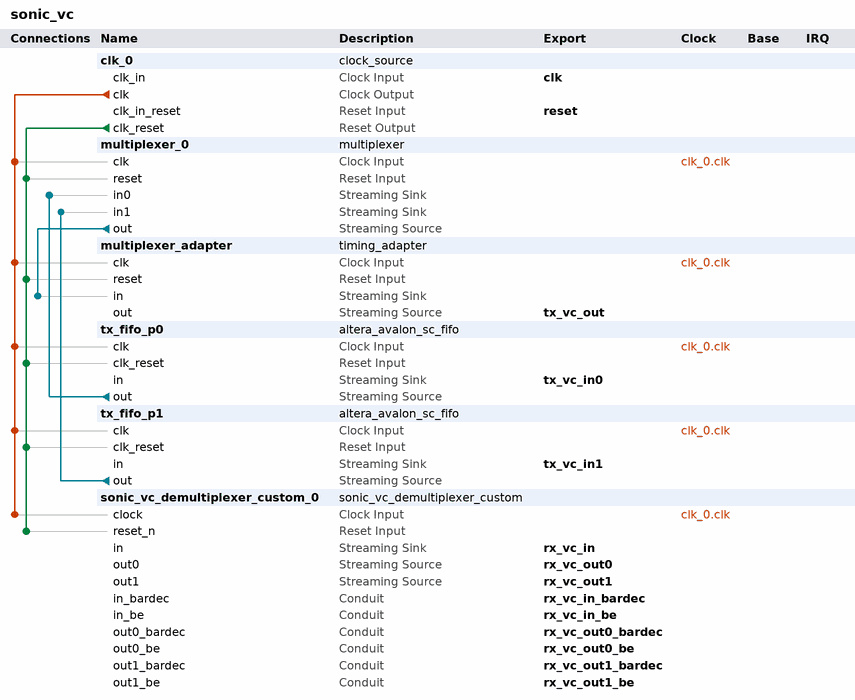
[diagram p0: system contents]
# Platform Designer (Qsys) system sonic_vc
# Parameters at their usual value, and those the tool derives, are not listed.
package require -exact qsys 11.0
create_system sonic_vc
set_project_property DEVICE_FAMILY STRATIXIV

add_instance clk_0 clock_source 11.0
set_instance_parameter_value clk_0 clockFrequency 250000000

add_instance multiplexer_0 multiplexer 11.0
set_instance_parameter_value multiplexer_0 bitsPerSymbol 64
set_instance_parameter_value multiplexer_0 errorWidth 1
set_instance_parameter_value multiplexer_0 generationLanguage VERILOG
set_instance_parameter_value multiplexer_0 numInputInterfaces 2
set_instance_parameter_value multiplexer_0 outChannelWidth 1
set_instance_parameter_value multiplexer_0 packetScheduling true
set_instance_parameter_value multiplexer_0 schedulingSize 2
set_instance_parameter_value multiplexer_0 symbolsPerBeat 2
set_instance_parameter_value multiplexer_0 useHighBitsOfChannel true
set_instance_parameter_value multiplexer_0 usePackets true

add_instance multiplexer_adapter timing_adapter 11.0
set_instance_parameter_value multiplexer_adapter inBitsPerSymbol 64
set_instance_parameter_value multiplexer_adapter inChannelWidth 1
set_instance_parameter_value multiplexer_adapter inErrorWidth 1
set_instance_parameter_value multiplexer_adapter inMaxChannel 1
set_instance_parameter_value multiplexer_adapter inReadyLatency 0
set_instance_parameter_value multiplexer_adapter inSymbolsPerBeat 2
set_instance_parameter_value multiplexer_adapter inUseEmptyPort YES
set_instance_parameter_value multiplexer_adapter inUsePackets true
set_instance_parameter_value multiplexer_adapter inUseReady true
set_instance_parameter_value multiplexer_adapter inUseValid true
set_instance_parameter_value multiplexer_adapter outReadyLatency 2
set_instance_parameter_value multiplexer_adapter outUseReady true
set_instance_parameter_value multiplexer_adapter outUseValid true

add_instance tx_fifo_p0 altera_avalon_sc_fifo 11.0
set_instance_parameter_value tx_fifo_p0 SYMBOLS_PER_BEAT 2
set_instance_parameter_value tx_fifo_p0 BITS_PER_SYMBOL 64
set_instance_parameter_value tx_fifo_p0 FIFO_DEPTH 4096
set_instance_parameter_value tx_fifo_p0 CHANNEL_WIDTH 0
set_instance_parameter_value tx_fifo_p0 ERROR_WIDTH 1
set_instance_parameter_value tx_fifo_p0 USE_PACKETS 1
set_instance_parameter_value tx_fifo_p0 USE_FILL_LEVEL 0
set_instance_parameter_value tx_fifo_p0 USE_MEMORY_BLOCKS 1
set_instance_parameter_value tx_fifo_p0 USE_STORE_FORWARD 0

add_instance tx_fifo_p1 altera_avalon_sc_fifo 11.0
set_instance_parameter_value tx_fifo_p1 SYMBOLS_PER_BEAT 2
set_instance_parameter_value tx_fifo_p1 BITS_PER_SYMBOL 64
set_instance_parameter_value tx_fifo_p1 FIFO_DEPTH 4096
set_instance_parameter_value tx_fifo_p1 CHANNEL_WIDTH 0
set_instance_parameter_value tx_fifo_p1 ERROR_WIDTH 1
set_instance_parameter_value tx_fifo_p1 USE_PACKETS 1
set_instance_parameter_value tx_fifo_p1 USE_FILL_LEVEL 0
set_instance_parameter_value tx_fifo_p1 USE_MEMORY_BLOCKS 1
set_instance_parameter_value tx_fifo_p1 USE_STORE_FORWARD 0

add_instance sonic_vc_demultiplexer_custom_0 sonic_vc_demultiplexer_custom 1.0

# connections
add_connection clk_0.clk multiplexer_0.clk clock
add_connection clk_0.clk multiplexer_adapter.clk clock
add_connection clk_0.clk sonic_vc_demultiplexer_custom_0.clock clock
add_connection clk_0.clk tx_fifo_p0.clk clock
add_connection clk_0.clk tx_fifo_p1.clk clock
add_connection clk_0.clk_reset multiplexer_0.reset reset
add_connection clk_0.clk_reset multiplexer_adapter.reset reset
add_connection clk_0.clk_reset sonic_vc_demultiplexer_custom_0.reset_n reset
add_connection clk_0.clk_reset tx_fifo_p0.clk_reset reset
add_connection clk_0.clk_reset tx_fifo_p1.clk_reset reset
add_connection multiplexer_0.out multiplexer_adapter.in avalon_streaming
add_connection tx_fifo_p0.out multiplexer_0.in0 avalon_streaming
add_connection tx_fifo_p1.out multiplexer_0.in1 avalon_streaming

# exported interfaces
add_interface clk clock sink
set_interface_property clk EXPORT_OF clk_0.clk_in
add_interface reset reset sink
set_interface_property reset EXPORT_OF clk_0.clk_in_reset
add_interface tx_vc_out avalon_streaming source
set_interface_property tx_vc_out EXPORT_OF multiplexer_adapter.out
add_interface tx_vc_in0 avalon_streaming sink
set_interface_property tx_vc_in0 EXPORT_OF tx_fifo_p0.in
add_interface tx_vc_in1 avalon_streaming sink
set_interface_property tx_vc_in1 EXPORT_OF tx_fifo_p1.in
add_interface rx_vc_in avalon_streaming sink
set_interface_property rx_vc_in EXPORT_OF sonic_vc_demultiplexer_custom_0.in
add_interface rx_vc_out1 avalon_streaming source
set_interface_property rx_vc_out1 EXPORT_OF sonic_vc_demultiplexer_custom_0.out1
add_interface rx_vc_out0 avalon_streaming source
set_interface_property rx_vc_out0 EXPORT_OF sonic_vc_demultiplexer_custom_0.out0
add_interface rx_vc_in_bardec conduit end
set_interface_property rx_vc_in_bardec EXPORT_OF sonic_vc_demultiplexer_custom_0.in_bardec
add_interface rx_vc_in_be conduit end
set_interface_property rx_vc_in_be EXPORT_OF sonic_vc_demultiplexer_custom_0.in_be
add_interface rx_vc_out0_bardec conduit end
set_interface_property rx_vc_out0_bardec EXPORT_OF sonic_vc_demultiplexer_custom_0.out0_bardec
add_interface rx_vc_out0_be conduit end
set_interface_property rx_vc_out0_be EXPORT_OF sonic_vc_demultiplexer_custom_0.out0_be
add_interface rx_vc_out1_bardec conduit end
set_interface_property rx_vc_out1_bardec EXPORT_OF sonic_vc_demultiplexer_custom_0.out1_bardec
add_interface rx_vc_out1_be conduit end
set_interface_property rx_vc_out1_be EXPORT_OF sonic_vc_demultiplexer_custom_0.out1_be

save_system sonic_vc.qsys
